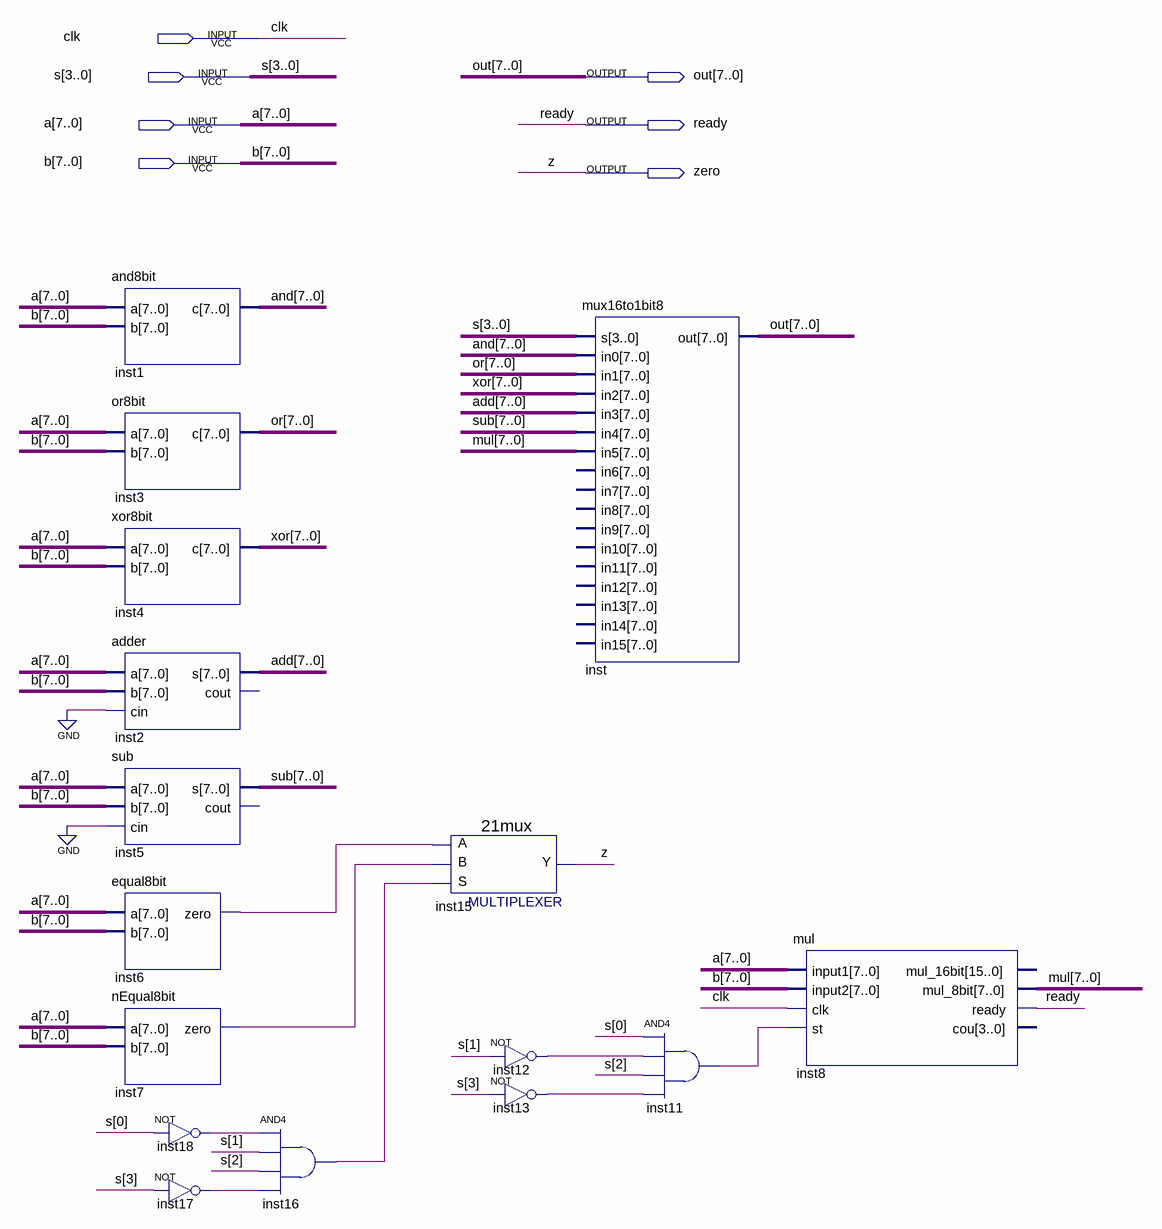
[diagram p0: schematic sheet]
// Quartus schematic ALU.bdf as structural Verilog: 16 symbols, 7 pins
module ALU (
  input  clk,
  input  [3:0] s,
  input  [7:0] a,
  input  [7:0] b,
  output [7:0] out,
  output ready,
  output zero
);

  wire inst6_zero, inst7_zero, inst11_out, inst12_out, inst13_out, inst16_out, inst17_out, inst18_out;
  wire [7:0] add, \and , mul, \or , sub, \xor ;

  and8bit inst1 (.a(a), .b(b), .c(\and ));
  or8bit inst3 (.a(a), .b(b), .c(\or ));
  xor8bit inst4 (.a(a), .b(b), .c(\xor ));
  adder inst2 (.a(a), .b(b), .cin(1'b0), .s(add));  // open: cout
  sub inst5 (.a(a), .b(b), .cin(1'b0), .s(sub));  // open: cout
  equal8bit inst6 (.a(a), .b(b), .zero(inst6_zero));
  nEqual8bit inst7 (.a(a), .b(b), .zero(inst7_zero));
  not inst18 (inst18_out, s[0]);
  not inst17 (inst17_out, s[3]);
  and inst16 (inst16_out, inst18_out, s[1], s[2], inst17_out);
  \21mux  inst15 (.S(inst16_out), .B(inst7_zero), .A(inst6_zero), .Y(zero));
  not inst12 (inst12_out, s[1]);
  not inst13 (inst13_out, s[3]);
  mux16to1bit8 inst (
    .s(s), .in0(\and ), .in1(\or ), .in2(\xor ), .in3(add), .in4(sub), .in5(mul), .out(out));  // open: in6, in7, in8, in9, in10, in11, in12, in13, in14, in15
  and inst11 (inst11_out, s[0], inst12_out, s[2], inst13_out);
  mul inst8 (
    .input1(a), .input2(b), .clk(clk), .st(inst11_out), .mul_8bit(mul), .ready(ready));  // open: mul_16bit, cou

  // Other names for the same wires on the sheet: z = zero
endmodule
